# EAGLE schematic Sonar-Amplifier (EAGLE 8.6.0)
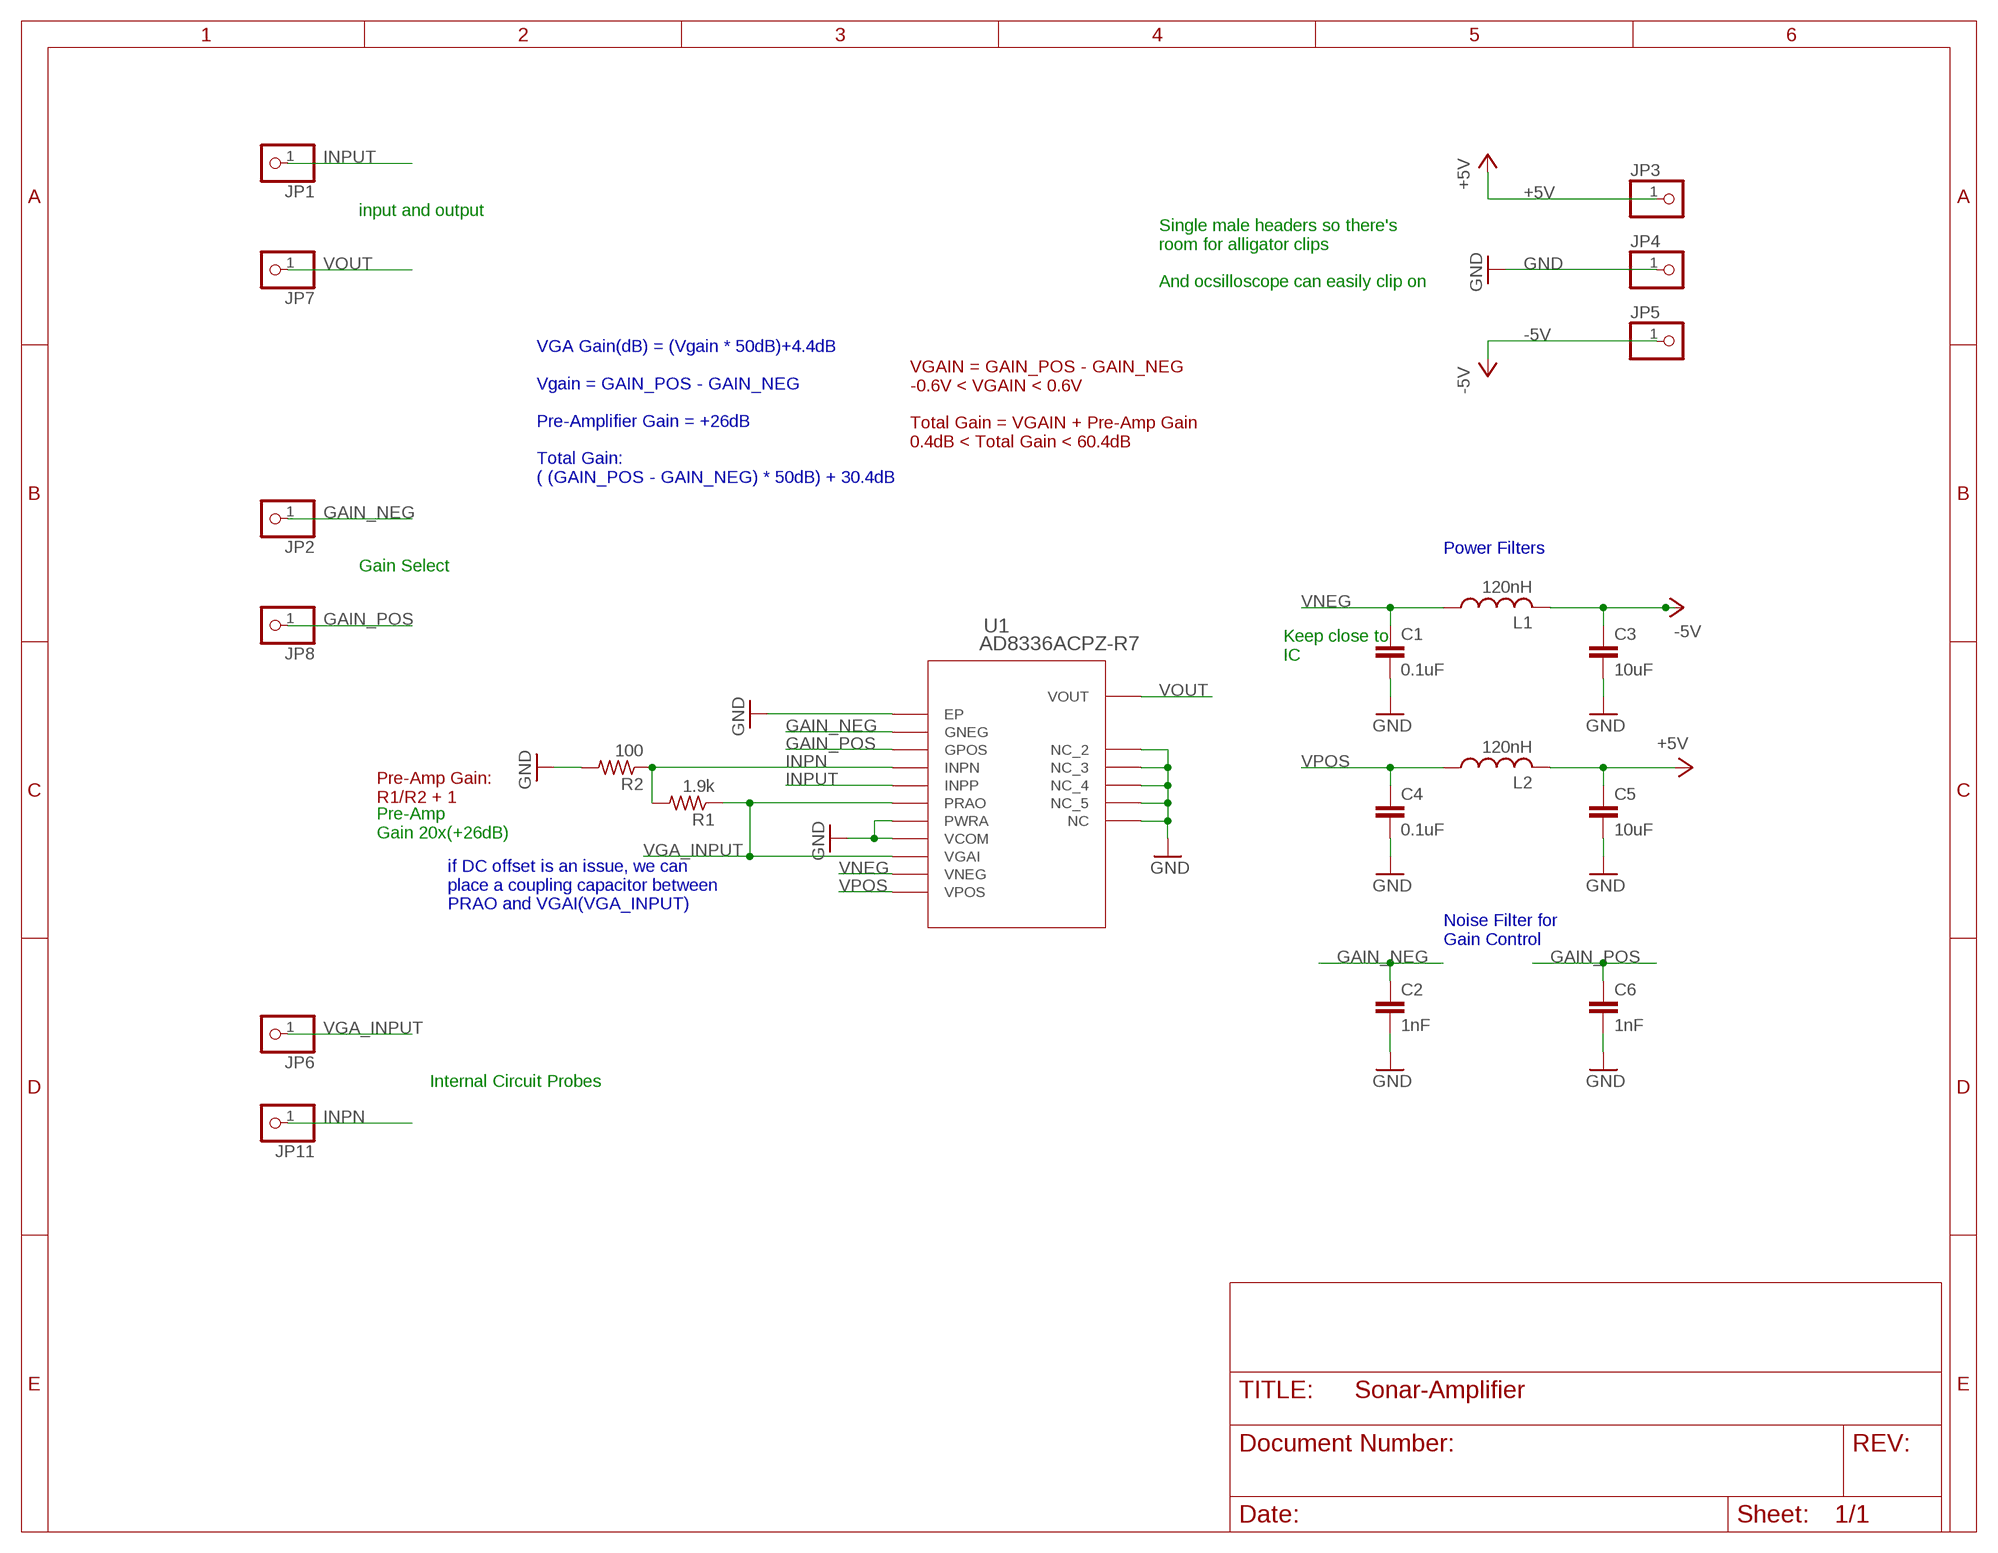
[diagram p0: schematic, sheet 1]

## Parts
C1  0.1uF  C-EUC0603  [C0603]
C2  1nF  C-EUC0603  [C0603]
C3  10uF  C-EUC1206  [C1206]
C4  0.1uF  C-EUC0603  [C0603]
C5  10uF  C-EUC1206  [C1206]
C6  1nF  C-EUC0603  [C0603]
JP1  PINHD-1X1  [1X01]
JP2  PINHD-1X1  [1X01]
JP3  PINHD-1X1  [1X01]
JP4  PINHD-1X1  [1X01]
JP5  PINHD-1X1  [1X01]
JP6  PINHD-1X1  [1X01]
JP7  PINHD-1X1  [1X01]
JP8  PINHD-1X1  [1X01]
JP11  PINHD-1X1  [1X01]
L1  120nH  L-USL3225P  [L3225P]
L2  120nH  L-USL3225P  [L3225P]
R1  1.9k  R-US_R0603  [R0603]
R2  100  R-US_R0603  [R0603]
U1  AD8336ACPZ-R7  [CP_16_4]

## Nets
+5V: C5.1 JP3.1 L2.2
-5V: C3.1 JP5.1 L1.2
GAIN_NEG: C2.1 JP2.1 U1.GNEG
GAIN_POS: C6.1 JP8.1 U1.GPOS
GND: C1.2 C2.2 C3.2 C4.2 C5.2 C6.2 JP4.1 R2.2 U1.GND1(EP) U1.NC U1.NC1(NC_2) U1.NC2(NC_3) U1.NC3(NC_4) U1.NC4(NC_5) U1.PWRA U1.VCOM
INPN: JP11.1 R1.2 R2.1 U1.INPN
INPUT: JP1.1 U1.INPP
VGA_INPUT: JP6.1 R1.1 U1.PRAO U1.VGAI
VNEG: C1.1 L1.1 U1.VNEG
VOUT: JP7.1 U1.VOUT
VPOS: C4.1 L2.1 U1.VPOS

## Notes on the sheet
- input and output
- Single male headers so there's
  room for alligator clips
  
  And ocsilloscope can easily clip on
- VGAIN = GAIN_POS - GAIN_NEG
  -0.6V < VGAIN < 0.6V
  
  Total Gain = VGAIN + Pre-Amp Gain
  0.4dB < Total Gain < 60.4dB
- VGA Gain(dB) = (Vgain * 50dB)+4.4dB
  
  Vgain = GAIN_POS - GAIN_NEG
  
  Pre-Amplifier Gain = +26dB
  
  Total Gain:
  ( (GAIN_POS - GAIN_NEG) * 50dB) + 30.4dB
- Power Filters
- Gain Select
- Keep close to 
  IC
- Pre-Amp Gain:
  R1/R2 + 1
- Pre-Amp 
  Gain 20x(+26dB)
- if DC offset is an issue, we can
  place a coupling capacitor between
  PRAO and VGAI(VGA_INPUT)
- Noise Filter for
  Gain Control
- Internal Circuit Probes

## Library data of the parts
C1 C2 C4 C6 = rcl:C-EU: CAPACITOR, European symbol; SPICEPREFIX: C
C3 C5 = resistor:C-EU: CAPACITOR, European symbol
JP1-JP8 JP11 = pinhead:PINHD-1X1: PIN HEADER
L1 L2 = resistor:L-US: INDUCTOR, American symbol
R1 R2 = rcl:R-US_: RESISTOR, American symbol; SPICEPREFIX: R
U1 = Amplifier-Sonar-LBR:AD8336ACPZ-R7; MANUFACTURER_PART_NUMBER: AD8336ACPZR7; VENDOR: Analog Devices Inc